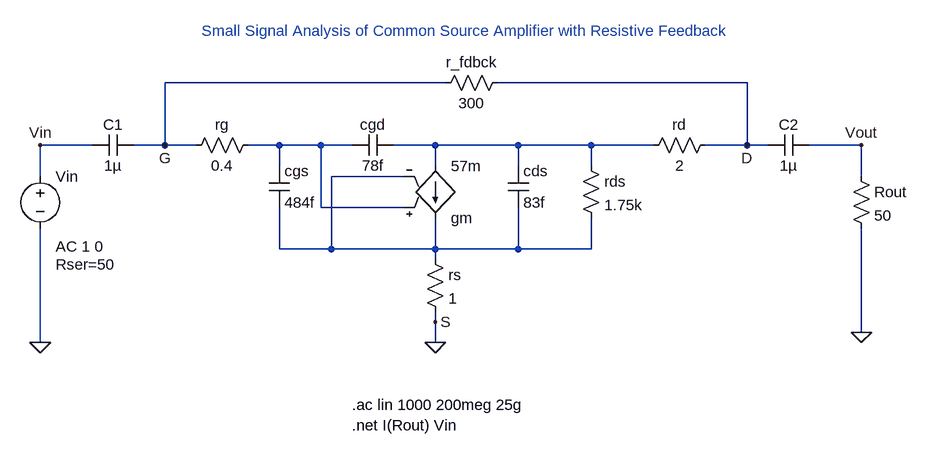
[diagram p0: schematic Small_Signal_Analysis_CSamp_Resistive_Feedback.asc]
Small_Signal_Analysis_CSamp_Resistive_Feedback.asc, the LTspice schematic file:
Version 4
SHEET 1 992 680
WIRE 272 -32 -160 -32
WIRE 736 -32 352 -32
WIRE -272 64 -352 64
WIRE -160 64 -160 -32
WIRE -160 64 -208 64
WIRE -112 64 -160 64
WIRE 16 64 -32 64
WIRE 80 64 16 64
WIRE 128 64 80 64
WIRE 256 64 192 64
WIRE 384 64 256 64
WIRE 496 64 384 64
WIRE 592 64 496 64
WIRE 736 64 736 -32
WIRE 736 64 672 64
WIRE 768 64 736 64
WIRE 912 64 832 64
WIRE 16 96 16 64
WIRE 256 96 256 64
WIRE 384 96 384 64
WIRE 496 96 496 64
WIRE -352 112 -352 64
WIRE 208 112 96 112
WIRE 912 112 912 64
WIRE 80 160 80 64
WIRE 208 160 80 160
WIRE 16 224 16 160
WIRE 96 224 96 112
WIRE 96 224 16 224
WIRE 256 224 256 176
WIRE 256 224 96 224
WIRE 384 224 384 160
WIRE 384 224 256 224
WIRE 496 224 496 176
WIRE 496 224 384 224
WIRE 256 240 256 224
WIRE 256 336 256 320
WIRE 912 352 912 192
WIRE -352 368 -352 192
WIRE 256 368 256 336
FLAG 256 368 0
FLAG 912 352 0
FLAG 736 64 D
FLAG 256 336 S
FLAG -352 368 0
FLAG -160 64 G
FLAG -352 64 Vin
FLAG 912 64 Vout
SYMBOL g 256 192 M180
SYMATTR InstName gm
SYMATTR Value 57m
SYMBOL res 240 224 R0
SYMATTR InstName rs
SYMATTR Value 1
SYMBOL cap 0 96 R0
SYMATTR InstName cgs
SYMATTR Value 484f
SYMBOL cap 368 96 R0
SYMATTR InstName cds
SYMATTR Value 83f
SYMBOL res 480 80 R0
SYMATTR InstName rds
SYMATTR Value 1.75k
SYMBOL cap 192 48 R90
WINDOW 0 0 32 VBottom 2
WINDOW 3 32 32 VTop 2
SYMATTR InstName cgd
SYMATTR Value 78f
SYMBOL res 688 48 R90
WINDOW 0 0 56 VBottom 2
WINDOW 3 32 56 VTop 2
SYMATTR InstName rd
SYMATTR Value 2
SYMBOL cap 832 48 R90
WINDOW 0 0 32 VBottom 2
WINDOW 3 32 32 VTop 2
SYMATTR InstName C2
SYMATTR Value 1µ
SYMBOL res 896 96 R0
SYMATTR InstName Rout
SYMATTR Value 50
SYMBOL res -16 48 R90
WINDOW 0 0 56 VBottom 2
WINDOW 3 32 56 VTop 2
SYMATTR InstName rg
SYMATTR Value 0.4
SYMBOL cap -208 48 R90
WINDOW 0 0 32 VBottom 2
WINDOW 3 32 32 VTop 2
SYMATTR InstName C1
SYMATTR Value 1µ
SYMBOL voltage -352 96 R0
WINDOW 123 24 124 Left 2
WINDOW 39 24 152 Left 2
SYMATTR Value2 AC 1 0
SYMATTR SpiceLine Rser=50
SYMATTR InstName Vin
SYMATTR Value ""
SYMBOL res 368 -48 R90
WINDOW 0 0 56 VBottom 2
WINDOW 3 32 56 VTop 2
SYMATTR InstName r_fdbck
SYMATTR Value 300
TEXT 128 464 Left 2 !.ac lin 1000 200meg 25g\n.net I(Rout) Vin
TEXT -104 -112 Left 2 ;Small Signal Analysis of Common Source Amplifier with Resistive Feedback

The netlist it stands for:
* Small_Signal_Analysis_CSamp_Resistive_Feedback.asc
gm N002 N003 N001 N003 57m
rs N003 0 1
cgs N001 N003 484f
cds N002 N003 83f
rds N002 N003 1.75k
cgd N002 N001 78f
rd D N002 2
C2 Vout D 1µ
Rout Vout 0 50
rg N001 G 0.4
C1 G Vin 1µ
Vin Vin 0 AC 1 0 Rser=50
r_fdbck D G 300
.ac lin 1000 200meg 25g
.net I(Rout) Vin
* Small Signal Analysis of Common Source Amplifier with Resistive Feedback
.backanno
.end